# EAGLE design scm (EAGLE 7.6.0)
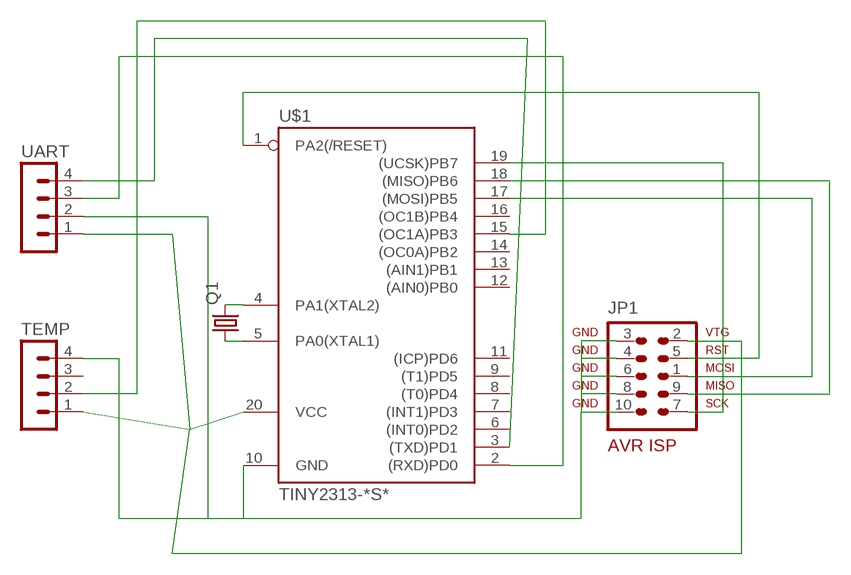
[diagram p0: schematic, sheet 1]

## Parts
JP1  AVR-ISP-10  [AVR-ISP-10]
Q1  CRYSTALHC49U70  [HC49U70]
TEMP  MA04-1  [MA04-1]
U$1  TINY2313-*S*  [SO20L$]
UART  MA04-1  [MA04-1]

## Nets
N$1: JP1.3 JP1.4 JP1.6 JP1.8 JP1.10 TEMP.4 U$1.10(GND) UART.2
N$2: JP1.2 TEMP.1 U$1.20(VCC) UART.1
N$3: JP1.5 U$1.1(PA2(/RESET))
N$4: JP1.7 U$1.19((UCSK)PB7)
N$5: JP1.1 U$1.17((MOSI)PB5)
N$6: JP1.9 U$1.18((MISO)PB6)
N$8: TEMP.2 U$1.15((OC1A)PB3)
N$9: U$1.2((RXD)PD0) UART.3
N$10: U$1.3((TXD)PD1) UART.4
N$16: Q1.2 U$1.4(PA1(XTAL2))
N$17: Q1.1 U$1.5(PA0(XTAL1))
Unconnected: TEMP.3 U$1.6((INT0)PD2) U$1.7((INT1)PD3) U$1.8((T0)PD4) U$1.9((T1)PD5) U$1.11((ICP)PD6) U$1.12((AIN0)PB0) U$1.13((AIN1)PB1) U$1.14((OC0A)PB2) U$1.16((OC1B)PB4)

## Library data of the parts
JP1 = avr-6:AVR-ISP-10: AVR ISP-10 Serial Programming Header
Q1 = crystal:CRYSTAL: CRYSTAL; OC_FARNELL: unknown; OC_NEWARK: unknown
TEMP UART = con-lstb:MA04-1: PIN HEADER; OC_FARNELL: unknown; OC_NEWARK: unknown
U$1 = avr-6:TINY2313*: Atmel Tiny2313 2K Flash, 128 bytes EEPROM, 128 bytes RAM

## Board
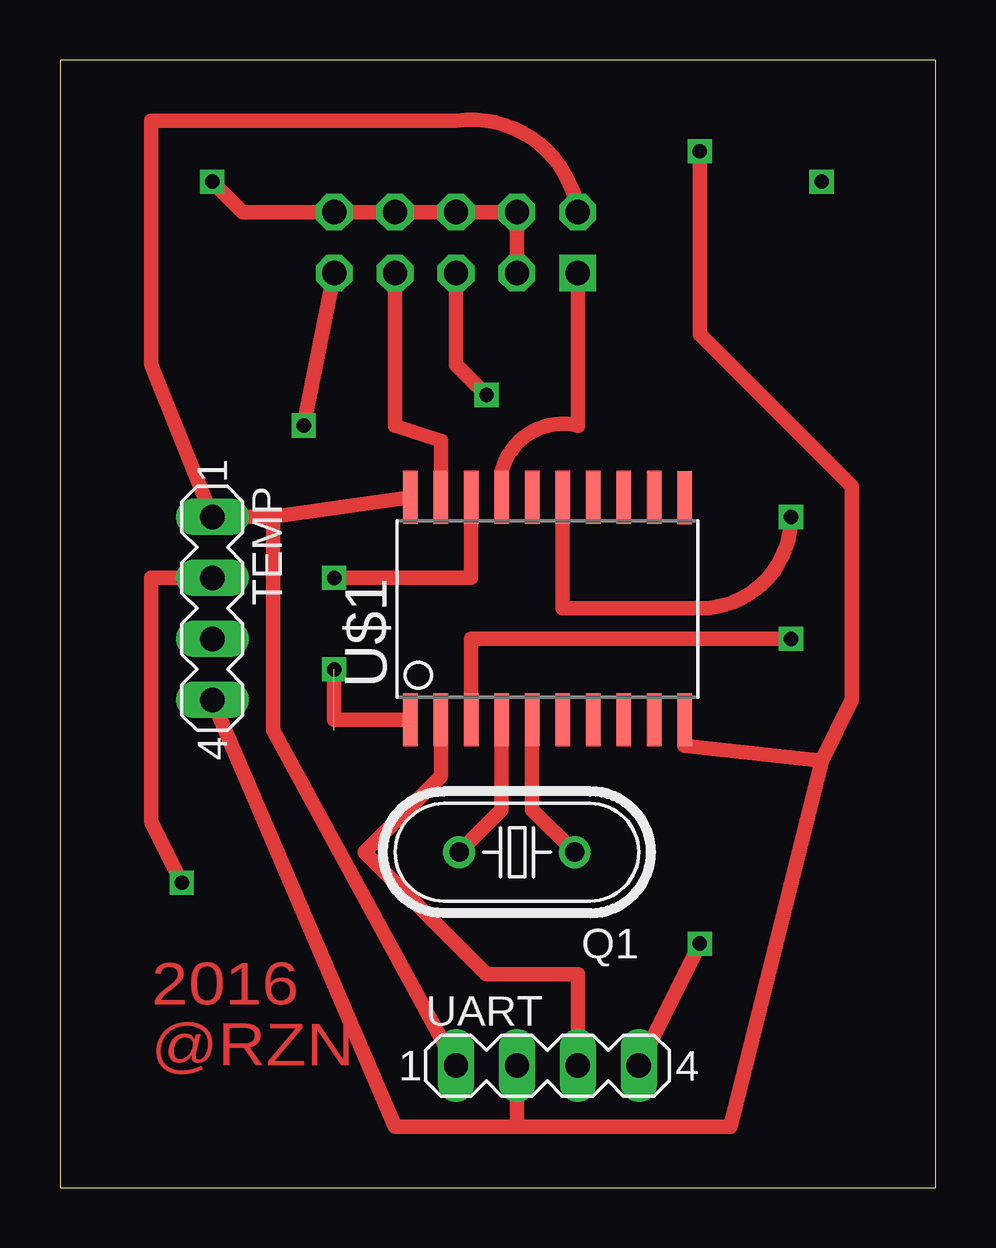
[diagram p1: board, top side]
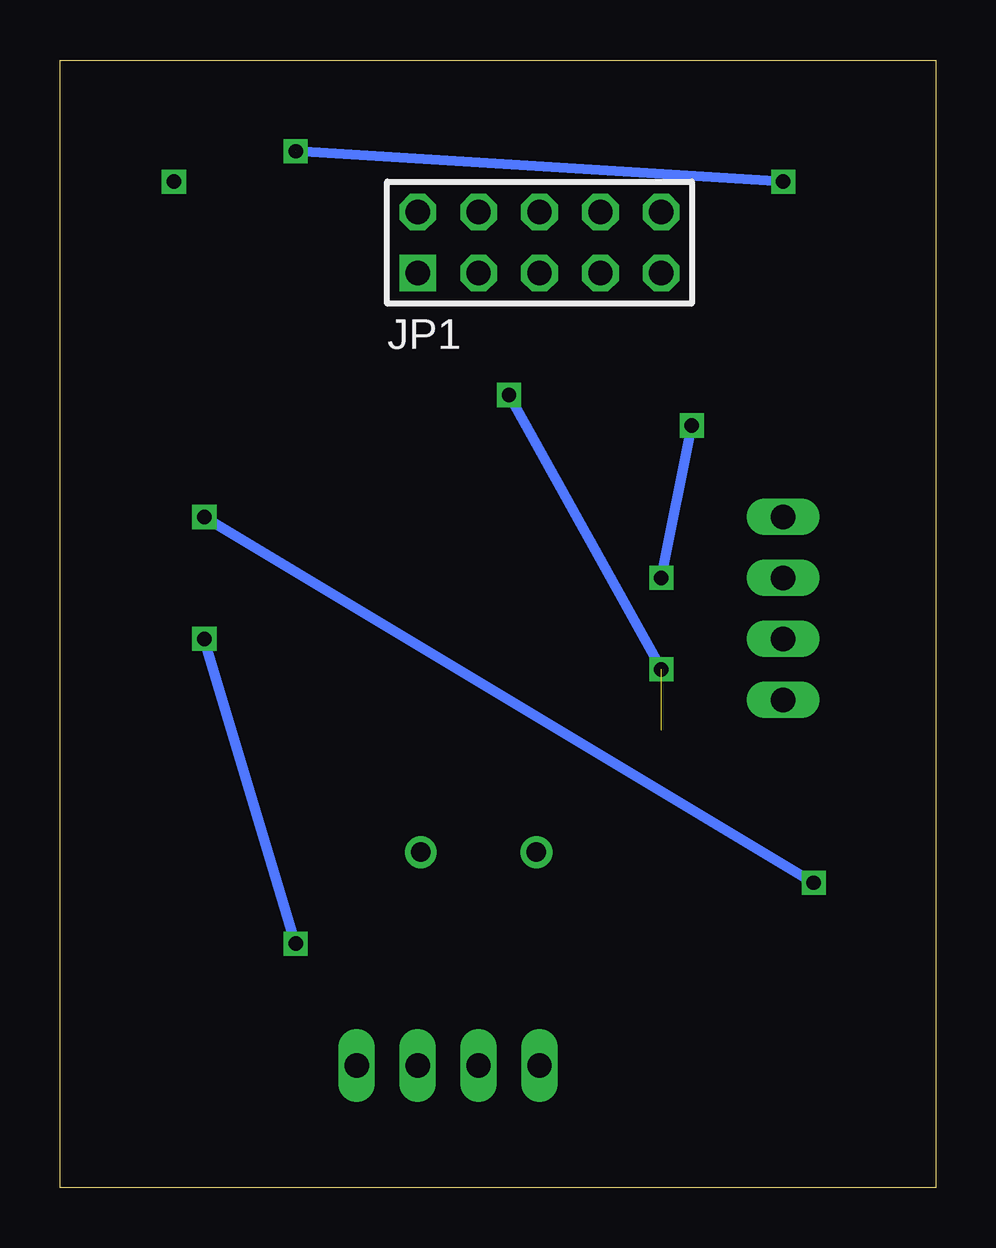
[diagram p2: board, bottom side, seen from below]

Size 36.5 x 46.98 mm. Coordinates in mm from the lower left corner, seen from the top.
Outline: 0,0 36.5,0 36.5,46.98 0,46.98 0,0
Copper layers (1*16): Top 0.035mm / dielectric 1.5mm / Bottom 0.035mm
Design rules "default": minimum track width 10mil, minimum drill 24mil, track to track 8mil, track to pad 8mil, pad to pad 8mil, via to via 8mil, smd to smd 8mil, copper to edge 40mil, drill to drill 8mil, minimum pad ring 10mil, minimum via ring 8mil, stop-mask expansion 4mil, vias tented up to drill 0mil, thermal gap 10mil

### Footprints (pad centres in the part's own frame; a part is rotated, then mirrored left to right if it is on the bottom)
AVR-ISP-10 = drill 1.016 square: 1 -5.08,-1.27 | drill 1.016 octagon: 2 -5.08,1.27; 3 -2.54,-1.27; 4 -2.54,1.27; 5 0,-1.27; 6 0,1.27; 7 2.54,-1.27; 8 2.54,1.27; 9 5.08,-1.27; 10 5.08,1.27
HC49U70 = drill 0.813: 1 -2.413,0; 2 2.413,0
MA04-1 = drill 1.016 long: 1 -3.81,0; 2 -1.27,0; 3 1.27,0; 4 3.81,0
SO20L$ = smd 0.61 x 2.21: 1 -5.715,-4.636; 2 -4.445,-4.636; 3 -3.175,-4.636; 4 -1.905,-4.636; 5 -0.635,-4.636; 6 0.635,-4.636; 7 1.905,-4.636; 8 3.175,-4.636; 9 4.445,-4.636; 10 5.715,-4.636; 11 5.715,4.61; 12 4.445,4.636; 13 3.175,4.636; 14 1.905,4.636; 15 0.635,4.636; 16 -0.635,4.636; 17 -1.905,4.636; 18 -3.175,4.636; 19 -4.445,4.636; 20 -5.715,4.636

### Placement (x,y rotation side)
JP1  16.51,39.37 0 bottom
Q1  19.05,13.97 180 top
TEMP  6.35,24.13 270 top
U$1  20.32,24.13 0 top
UART  20.32,5.08 0 top

### Tracks (layer width: path | path; a pad name or v marks a point on that pad's centre or on a via)
N$1  (1 unrouted)
  Top 0.406: U$1.10 26.04,18.41
  Top 0.61: 26.04,18.41 31.75,17.78 | 31.75,17.78 33.02,20.32 33.02,29.21 26.67,35.56 26.67,43.18 | UART.2 19.05,2.54 | 19.05,2.54 13.97,2.54 TEMP.4 | 19.05,2.54 27.94,2.54 31.75,17.78 | JP1.3 JP1.4 JP1.6 JP1.8 JP1.10 7.62,40.64 6.35,41.91
  Bottom 0.406: 6.35,41.91 26.67,43.18
N$2
  Top 0.406: TEMP.1 7.62,27.94
  Top 0.61: TEMP.1 3.81,34.29 3.81,44.45 16.51,44.45 arc-90 JP1.2 | UART.1 8.89,19.05 8.89,27.94 | U$1.20 8.89,27.94 | 7.62,27.94 8.89,27.94
N$3  (via drill 0.6)  (2 unrouted)
  Top 0.61: v17.78,33.02 16.51,34.29 JP1.5 | U$1.1 11.43,19.5 11.43,21.59
  Bottom 0.406: v17.78,33.02 11.43,21.59
N$4
  Top 0.61: JP1.7 13.97,31.75 15.88,31.11 U$1.19
N$5
  Top 0.406: U$1.17 18.41,29.84
  Top 0.61: 18.41,29.84 arc-90 21.59,31.75 JP1.1
N$6  (via drill 0.6)
  Top 0.61: U$1.18 17.14,25.4 v11.43,25.4 | v10.16,31.75 JP1.9
  Bottom 0.406: v11.43,25.4 v10.16,31.75
N$7  (via drill 0.6)
  other vias: 11.43,21.59
N$8  (via drill 0.6)
  Top 0.61: U$1.15 20.96,24.13 26.67,24.13 arc90 30.48,27.94 | TEMP.2 3.81,25.4 3.81,15.24 v5.08,12.7
  Bottom 0.406: 30.48,27.94 v5.08,12.7
N$9
  Top 0.61: U$1.2 15.88,17.14 12.7,13.97 17.78,8.89 21.59,8.89 UART.3
N$10  (via drill 0.6)
  Top 0.61: U$1.3 17.14,22.86 v30.48,22.86 | UART.4 26.67,10.16
  Bottom 0.406: 26.67,10.16 v30.48,22.86
N$11  (via drill 0.6)
  other vias: 6.35,41.91
N$13  (via drill 0.6)
  other vias: 30.48,27.94
N$14  (via drill 0.6)
  other vias: 26.67,43.18
N$15  (via drill 0.6)
  other vias: 31.75,41.91
N$16
  Top 0.61: U$1.4 18.41,15.75 Q1.2
N$17
  Top 0.61: U$1.5 19.68,15.75 Q1.1
N$18  (via drill 0.6)
  other vias: 26.67,10.16

### Text on the board
Top: 2016 | @RZN